# EAGLE design moderkort (EAGLE 6.5.0)
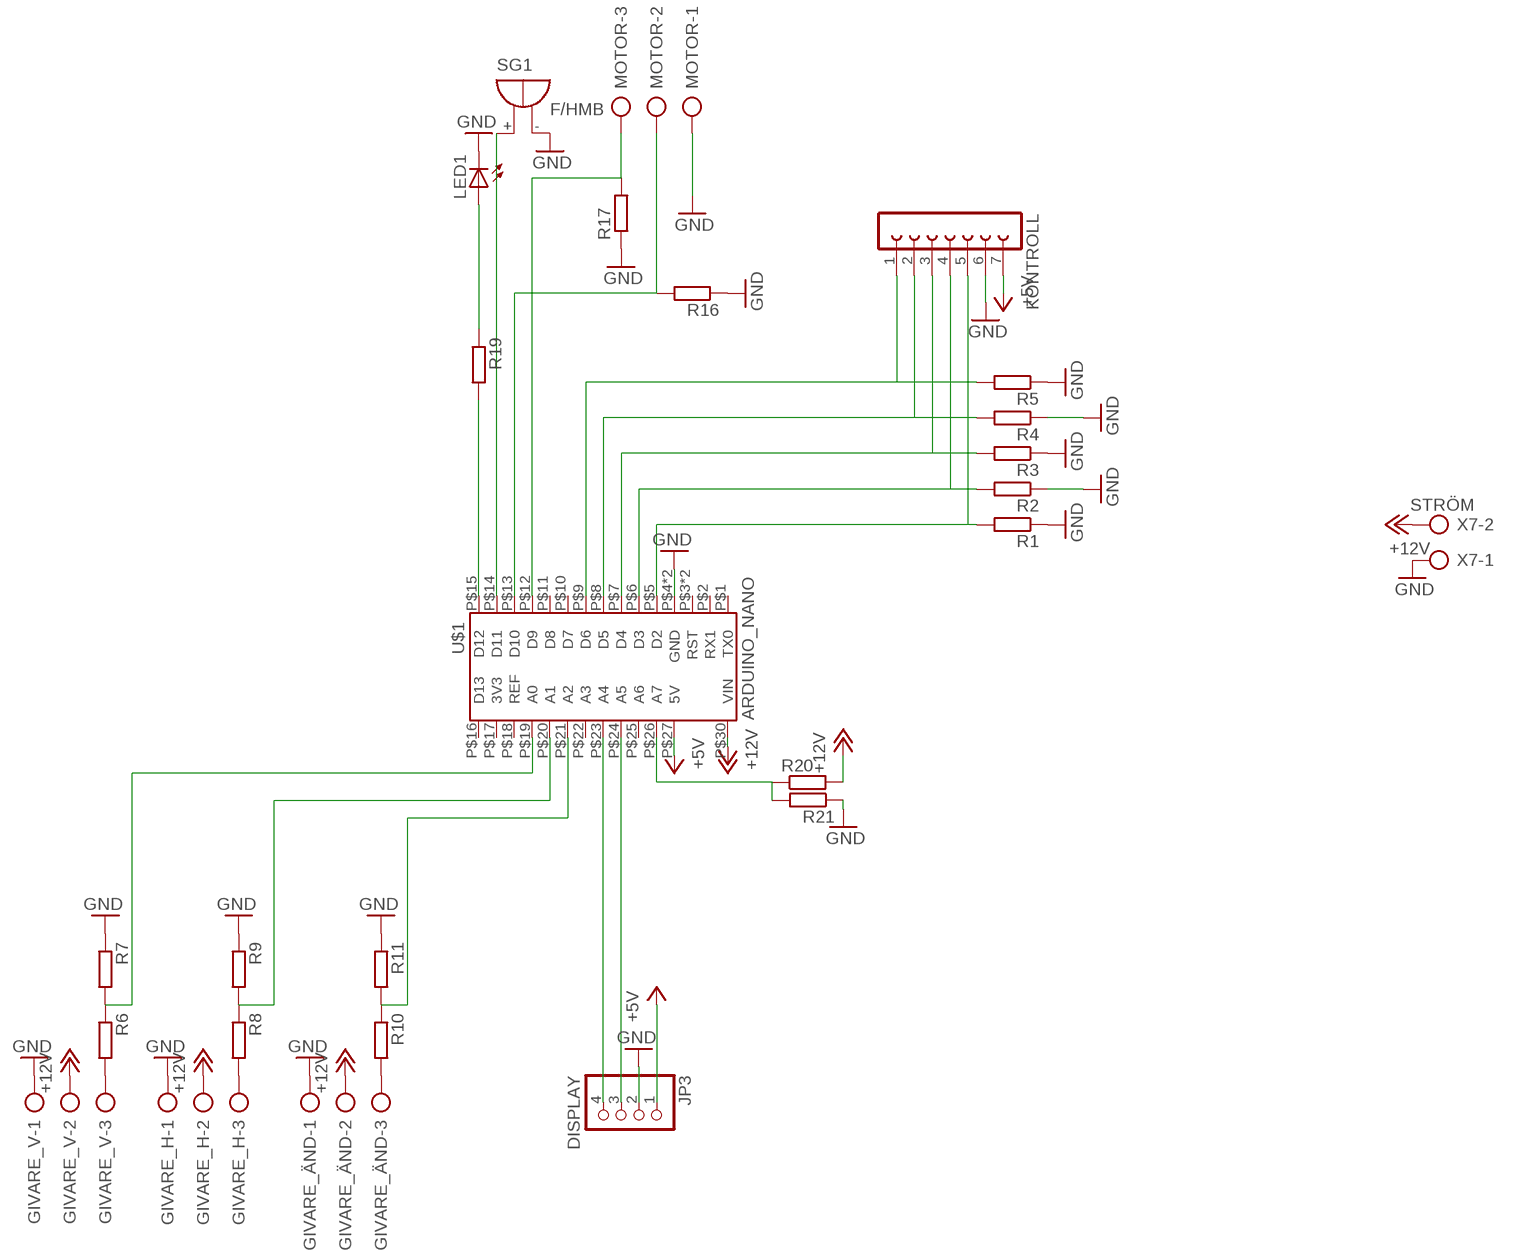
[diagram p0: schematic, sheet 1]

## Parts
GIVARE_H  AK500/3  [AK500/3]
GIVARE_V  AK500/3  [AK500/3]
GIVARE_ÄND  AK500/3  [AK500/3]
JP3  DISPLAY  PINHD-1X4  [1X04]
KONTROLL  FE07-1  [FE07]
LED1  LED5MM  [LED5MM]
MOTOR  AK500/3  [AK500/3]
R1  R-EU_M1206  [M1206]
R2  R-EU_M1206  [M1206]
R3  R-EU_M1206  [M1206]
R4  R-EU_M1206  [M1206]
R5  R-EU_M1206  [M1206]
R6  R-EU_M1206  [M1206]
R7  R-EU_M1206  [M1206]
R8  R-EU_M1206  [M1206]
R9  R-EU_M1206  [M1206]
R10  R-EU_M1206  [M1206]
R11  R-EU_M1206  [M1206]
R16  R-EU_M1206  [M1206]
R17  R-EU_M1206  [M1206]
R19  R-EU_M1206  [M1206]
R20  R-EU_M1206  [M1206]
R21  R-EU_M1206  [M1206]
SG1  F/HMB  [F/HMB]
U$1  ARDUINO_NANO  [ARDUINO_NANO]
X7  STRÖM  AK500/2  [AK500/2]

## Nets
+5V: JP3.1 KONTROLL.7 U$1.P$27(5V)
+12V: GIVARE_H.2 GIVARE_V.2 GIVARE_ÄND.2 R20.2 U$1.P$30(VIN) X7.2
GND: GIVARE_H.1 GIVARE_V.1 GIVARE_ÄND.1 JP3.2 KONTROLL.6 LED1.K(C) MOTOR.1 R1.1 R2.1 R3.1 R4.1 R5.1 R7.1 R9.1 R11.1 R16.1 R17.1 R21.1 SG1.- U$1.P$4(GND) U$1.P$29(GND) X7.1
N$1: LED1.A R19.1
N$2: GIVARE_V.3 R6.2
N$3: R6.1 R7.2 U$1.P$19(A0)
N$4: GIVARE_H.3 R8.2
N$5: R8.1 R9.2 U$1.P$20(A1)
N$6: GIVARE_ÄND.3 R10.2
N$7: R10.1 R11.2 U$1.P$21(A2)
N$10: MOTOR.3 R17.2 U$1.P$12(D9)
N$11: JP3.3 U$1.P$24(A5)
N$12: JP3.4 U$1.P$23(A4)
N$13: R19.2 U$1.P$15(D12)
N$22: KONTROLL.5 R1.2 U$1.P$5(D2)
N$23: KONTROLL.4 R2.2 U$1.P$6(D3)
N$24: KONTROLL.3 R3.2 U$1.P$7(D4)
N$25: KONTROLL.2 R4.2 U$1.P$8(D5)
N$26: KONTROLL.1 R5.2 U$1.P$9(D6)
N$29: SG1.+ U$1.P$14(D11)
N$30: MOTOR.2 R16.2 U$1.P$13(D10)
N$32: R20.1 R21.2 U$1.P$26(A7)
Unconnected: U$1.P$1(TX0) U$1.P$2(RX1) U$1.P$3(RST) U$1.P$10(D7) U$1.P$11(D8) U$1.P$16(D13) U$1.P$17(3V3) U$1.P$18(REF) U$1.P$22(A3) U$1.P$25(A6) U$1.P$28(RST)

## Library data of the parts
GIVARE_H GIVARE_V GIVARE_ÄND MOTOR = con-ptr500:AK500/3: CONNECTOR; OC_FARNELL: unknown; OC_NEWARK: unknown
JP3 = pinhead:PINHD-1X4: PIN HEADER
KONTROLL = con-lsta:FE07-1: FEMALE HEADER; OC_FARNELL: unknown; OC_NEWARK: unknown
LED1 = led:LED: LED OSRAM: - CHIPLED LG R971, LG N971, LY N971, LG Q971, LY Q971, LO R971, LY R971 LH N974, LH R974 LS Q976, LO Q976, LY Q976 LO Q996 - Hyper CHIPLED LW Q18S LB Q993, LB Q99A, LB R99A - SideLED LS A670, LO A670, LY A670, LG A670, LP A670 LB A673, LV A673, LT A673, LW A673 LH A674 LY A675 LS A676, LA A676, LO A676, LY A676, LW A676 LS A679, LY A679, LG A679 - Hyper Micro SIDELED® LS Y876, LA Y876, LO Y876, LY Y876 LT Y87S - SmartLED LW L88C, LW L88S LB L89C, LB L89S, LG L890 LS L89K, LO L89K, LY L89K LS L896, LA L896, LO L896, LY L896 - TOPLED LS T670, LO T670, LY T670, LG T670, LP T670 LSG T670, LSP T670, LSY T670, LOP T670, LYG T670 LG T671, LOG T671, LSG T671 LB T673, LV T673, LT T673, LW T673 LH T674 LS T676, LA T676, LO T676, LY T676, LB T676, LH T676, LSB T676, LW T676 LB T67C, LV T67C, LT T67C, LS T67K, LO T67K, LY T67K, LW E67C LS E67B, LA E67B, LO E67B, LY E67B, LB E67C, LV E67C, LT E67C LW T67C LS T679, LY T679, LG T679 LS T770, LO T770, LY T770, LG T770, LP T770 LB T773, LV T773, LT T773, LW T773 LH T774 LS E675, LA E675, LY E675, LS T675 LS T776, LA T776, LO T776, LY T776, LB T776 LHGB T686 LT T68C, LB T68C - Hyper Mini TOPLED® LB M676 - Mini TOPLED Santana® LG M470 LS M47K, LO M47K, LY M47K Source: http://www.osram.convergy.de LUXEON: - LUMILED® LXK2-PW12-R00, LXK2-PW12-S00, LXK2-PW14-U00, LXK2-PW14-V00 LXK2-PM12-R00, LXK2-PM12-S00, LXK2-PM14-U00 LXK2-PE12-Q00, LXK2-PE12-R00, LXK2-PE12-S00, LXK2-PE14-T00, LXK2-PE14-U00 LXK2-PB12-K00, LXK2-PB12-L00, LXK2-PB12-M00, LXK2-PB14-N00, LXK2-PB14-P00, LXK2-PB14-Q00 LXK2-PR12-L00, LXK2-PR12-M00, LXK2-PR14-Q00, LXK2-PR14-R00 LXK2-PD12-Q00, LXK2-PD12-R00, LXK2-PD12-S00 LXK2-PH12-R00, LXK2-PH12-S00 LXK2-PL12-P00, LXK2-PL12-Q00, LXK2-PL12-R00 Source: www.luxeon.com KINGBRIGHT: KA-3528ASYC Source: www.kingbright.com
R1-R11 R16 R17 R19-R21 = resistor:R-EU_: RESISTOR, European symbol
SG1 = buzzer:F/HMB: BUZZER Source: Buerklin; OC_FARNELL: unknown; OC_NEWARK: unknown
U$1 = custom:ARDUINO_NANO
X7 = con-ptr500:AK500/2: CONNECTOR; OC_FARNELL: unknown; OC_NEWARK: unknown

## Board
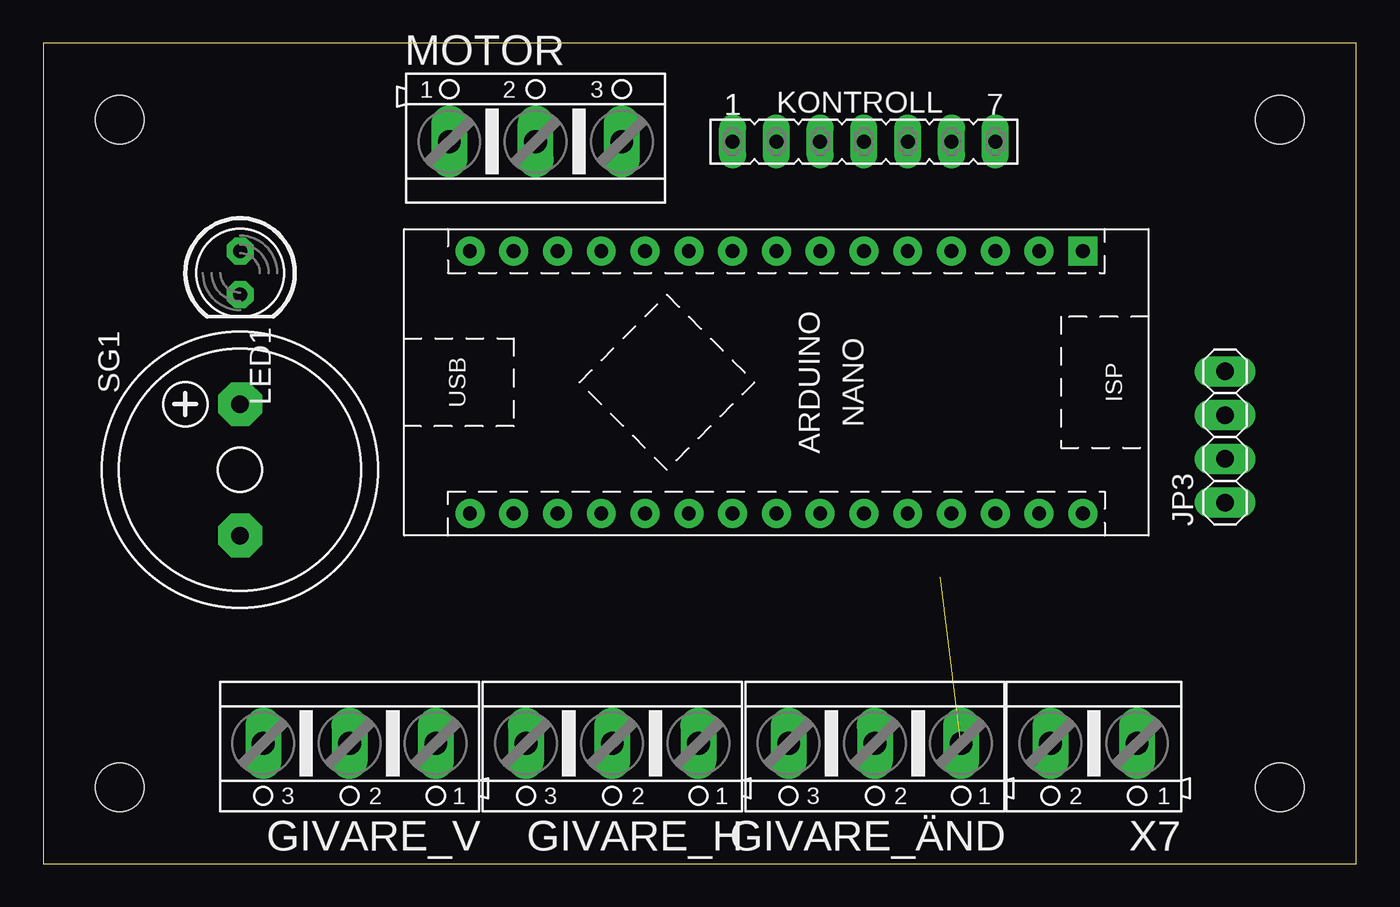
[diagram p1: board, top side]
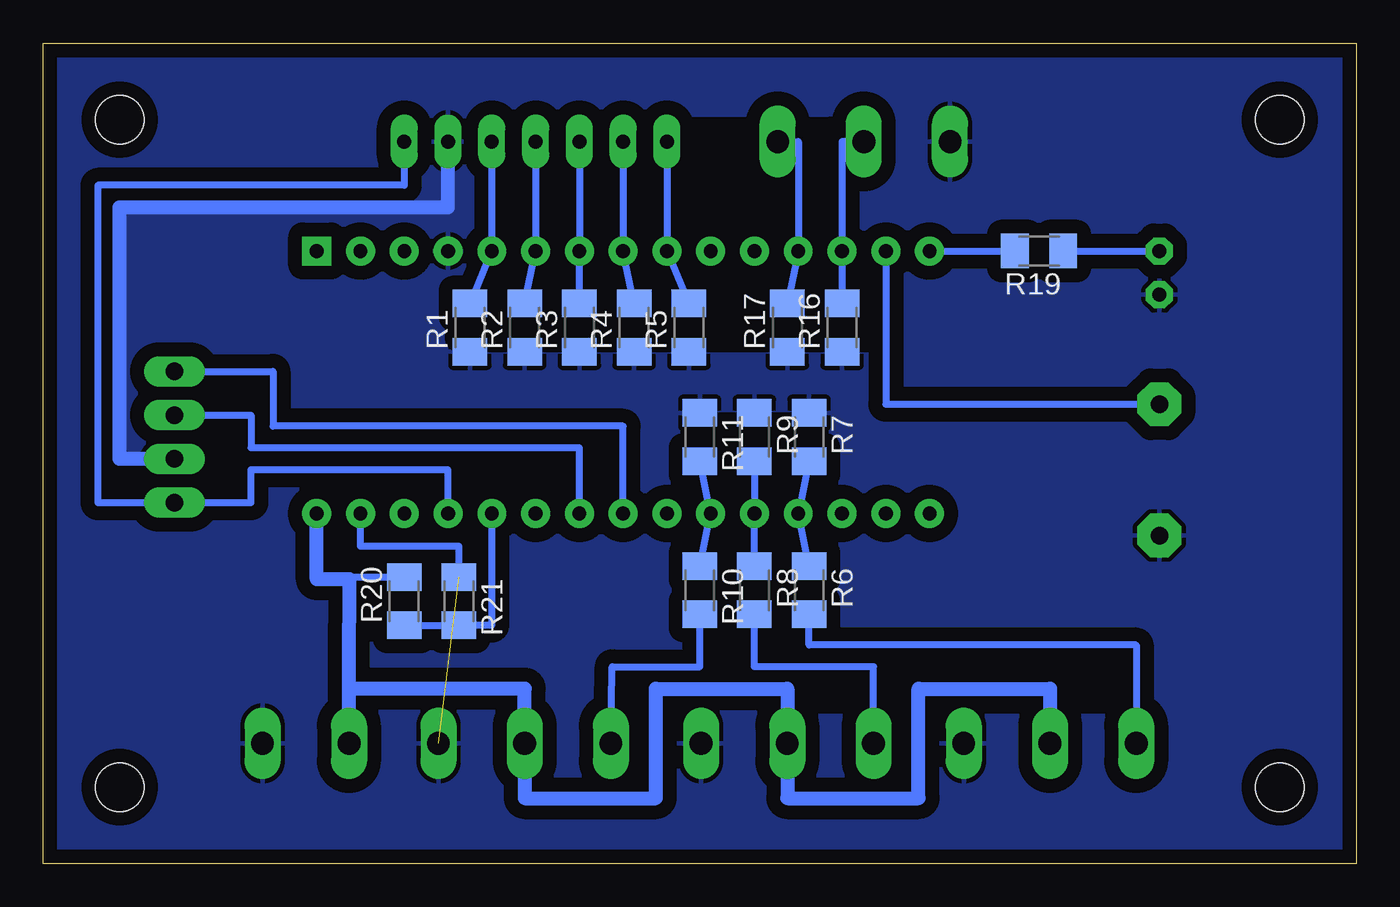
[diagram p2: board, bottom side, seen from below]

Size 76.2 x 47.62 mm. Coordinates in mm from the lower left corner, seen from the top.
Outline: 0,0 76.2,0 76.2,47.62 0,47.62 0,0
Copper layers (1*16): Top 0.035mm / dielectric 1.5mm / Bottom 0.035mm
Design rules "default *": minimum track width 10mil, minimum drill 24mil, track to track 8mil, track to pad 8mil, pad to pad 8mil, via to via 8mil, smd to smd 8mil, copper to edge 15mil, drill to drill 8mil, minimum pad ring 15mil, minimum via ring 8mil, stop-mask expansion 4mil, vias tented up to drill 0mil, thermal gap 10mil
Holes 2.8 mm at 4.45,43.18 71.75,43.18 71.75,4.45 4.45,4.45
bRestrict: area 51.4,17.8 to 59.1,19.1; area 46.4,21.6 to 51.4,23.5; area 27.9,33.7 to 50.8,34.9; area 33,18.4 to 37.5,22.2; area 53.3,21.6 to 54.6,22.2; area 52.1,14 to 57.8,16.5; area 23.5,8.3 to 24.8,8.9; area 38.7,8.3 to 39.4,8.9; area 13.3,9.5 to 34.3,12.1; area 27.9,30.5 to 52.1,31.8; area 34.9,32.4 to 36.8,33; area 30.5,36.2 to 50.2,42.5; 8 more areas

### Footprints (pad centres in the part's own frame; a part is rotated, then mirrored left to right if it is on the bottom)
AK500/3 = drill 1.321 long: 1 -5.004,0; 2 0,0; 3 5.004,0
1X04 = drill 1.016 long: 1 -3.81,0; 2 -1.27,0; 3 1.27,0; 4 3.81,0
FE07 = drill 0.813 long: 1 -7.62,0; 2 -5.08,0; 3 -2.54,0; 4 0,0; 5 2.54,0; 6 5.08,0; 7 7.62,0
LED5MM = drill 0.813 octagon: A -1.27,0; K 1.27,0
M1206 = smd 1.6 x 2: 1 -1.4,0; 2 1.4,0
F/HMB = drill 1.016 pad 2.54 octagon: + 3.81,0; - -3.81,0
ARDUINO_NANO = drill 0.8 pad 1.676 square: P$1 17.78,7.62 | drill 0.8 pad 1.676: P$2 15.24,7.62; P$3 12.7,7.62; P$4 10.16,7.62; P$5 7.62,7.62; P$6 5.08,7.62; P$7 2.54,7.62; P$8 0,7.62; P$9 -2.54,7.62; P$10 -5.08,7.62; P$11 -7.62,7.62; P$12 -10.16,7.62; P$13 -12.7,7.62; P$14 -15.24,7.62; P$15 -17.78,7.62; P$16 -17.78,-7.62; P$17 -15.24,-7.62; P$18 -12.7,-7.62; P$19 -10.16,-7.62; P$20 -7.62,-7.62; P$21 -5.08,-7.62; P$22 -2.54,-7.62; P$23 0,-7.62; P$24 2.54,-7.62; P$25 5.08,-7.62; P$26 7.62,-7.62; P$27 10.16,-7.62; P$28 12.7,-7.62; P$29 15.24,-7.62; P$30 17.78,-7.62
AK500/2 = drill 1.321 long: 1 -2.515,0; 2 2.515,0

### Placement (x,y rotation side)
GIVARE_H  33.02,6.99 180 top
GIVARE_V  17.78,6.99 180 top
GIVARE_ÄND  48.26,6.99 180 top
JP3  68.58,24.77 90 top
KONTROLL  47.62,41.91 0 top
LED1  11.43,34.29 270 top
MOTOR  28.57,41.91 0 top
R1  51.44,31.12 90 bottom
R2  48.26,31.12 90 bottom
R3  45.09,31.12 90 bottom
R4  41.91,31.12 90 bottom
R5  38.73,31.12 90 bottom
R6  31.75,15.88 270 bottom
R7  31.75,24.77 270 bottom
R8  34.92,15.88 270 bottom
R9  34.92,24.77 270 bottom
R10  38.1,15.88 270 bottom
R11  38.1,24.77 270 bottom
R16  29.84,31.12 90 bottom
R17  33.02,31.12 90 bottom
R19  18.41,35.56 180 bottom
R20  55.24,15.24 90 bottom
R21  52.07,15.24 270 bottom
SG1  11.43,22.86 90 top
U$1  42.55,27.94 0 top
X7  60.96,6.99 180 top

### Tracks (layer width: path | path; a pad name or v marks a point on that pad's centre or on a via)
+5V
  Bottom 0.406: U$1.P$27 52.7,22.86 64.13,22.86 64.13,20.96 JP3.1 73.03,20.96 73.03,39.37 55.24,39.37 KONTROLL.7
+12V
  Bottom 0.406: 58.42,16.51 58.42,16.64 R20.2
  Bottom 0.813: X7.2 58.45,10.16 | 58.45,10.16 58.45,11.43 58.42,16.51 60.33,16.51 U$1.P$30 | GIVARE_V.2 17.78,10.16 25.4,10.16 25.4,3.81 33.02,3.81 GIVARE_H.2 33.02,10.16 40.64,10.16 40.64,3.81 48.26,3.81 GIVARE_ÄND.2 48.26,10.16 58.45,10.16
GND  (1 unrouted)
  Bottom 0.406: R21.1 52.07,18.41 57.79,18.41 U$1.P$29
  Bottom 0.813: JP3.2 71.75,23.5 71.75,38.1 52.7,38.1 KONTROLL.6
  pour Bottom (isolate 0.813): 0,47.62 76.2,47.62 76.2,0 0,0
N$1
  Bottom 0.406: R19.1 LED1.A
N$2
  Bottom 0.406: GIVARE_V.3 12.78,12.7 31.75,12.7 R6.2
N$3
  Bottom 0.406: R7.2 U$1.P$19 R6.1
N$4
  Bottom 0.406: GIVARE_H.3 28.02,11.43 34.92,11.43 R8.2
N$5
  Bottom 0.406: R9.2 U$1.P$20 R8.1
N$6
  Bottom 0.406: GIVARE_ÄND.3 43.18,11.43 38.1,11.43 R10.2
N$7
  Bottom 0.406: R11.2 U$1.P$21 R10.1
N$8  (via drill 0.6 pad 1.42)
  other vias: 4.45,43.18
N$9  (via drill 0.6 pad 1.42)
  other vias: 4.45,4.45
N$10
  Bottom 0.406: R17.2 U$1.P$12 32.39,41.91 MOTOR.3
N$11
  Bottom 0.406: U$1.P$24 45.09,24.13 64.13,24.13 64.13,26.04 JP3.3
N$12
  Bottom 0.406: U$1.P$23 42.55,25.4 62.87,25.4 62.87,28.57 JP3.4
N$13
  Bottom 0.406: U$1.P$15 R19.2
N$14  (via drill 0.6 pad 1.42)
  other vias: 71.75,4.45
N$15  (via drill 0.6 pad 1.42)
  other vias: 71.75,43.18
N$22
  Bottom 0.406: KONTROLL.5 U$1.P$5 R1.2
N$23
  Bottom 0.406: KONTROLL.4 U$1.P$6 R2.2
N$24
  Bottom 0.406: KONTROLL.3 U$1.P$7 R3.2
N$25
  Bottom 0.406: KONTROLL.2 U$1.P$8 R4.2
N$26
  Bottom 0.406: KONTROLL.1 U$1.P$9 R5.2
N$29
  Bottom 0.406: U$1.P$14 27.3,26.67 SG1.+
N$30
  Bottom 0.406: R16.2 U$1.P$13 29.84,41.91 MOTOR.2
N$32
  Bottom 0.406: R20.1 R21.2 50.16,13.84 U$1.P$26